# Altium schematic sheet DSP.SchDoc
size A
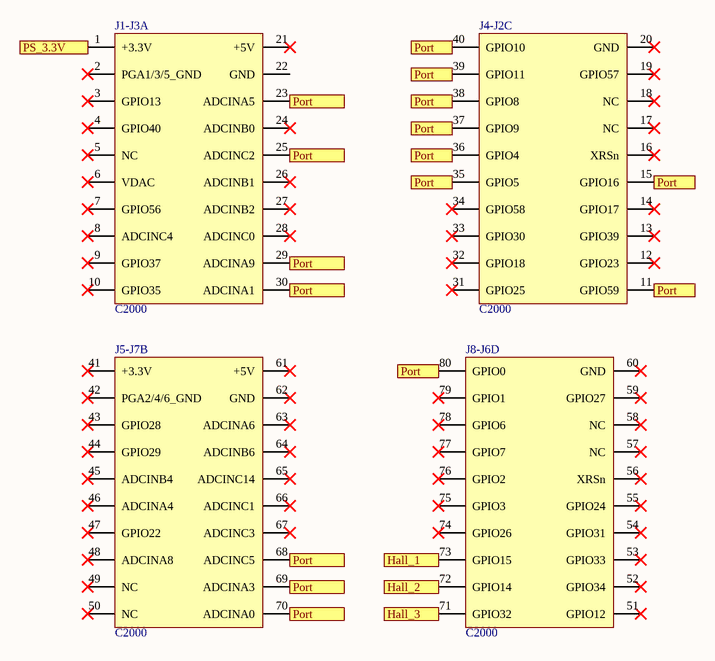
[diagram p0: DSP.SchDoc]

## Parts
J1-J3  C2000  [C2000]  (part A of 4)
J4-J2  C2000  [C2000]  (part C of 4)
J5-J7  C2000  [C2000]  (part B of 4)
J8-J6  C2000  [C2000]  (part D of 4)

## Ports
Hall_1 (in), Hall_2 (in), Hall_3 (in), Port (in), Port (out), PS_3.3V (in)

## Nets
Hall_1: J8-J6.73(GPIO15) ; port Hall_1
Hall_2: J8-J6.72(GPIO14) ; port Hall_2
Hall_3: J8-J6.71(GPIO32) ; port Hall_3
Port: J1-J3.23(ADCINA5) J1-J3.25(ADCINC2) J1-J3.29(ADCINA9) J1-J3.30(ADCINA1) J4-J2.11(GPIO59) J4-J2.15(GPIO16) J4-J2.35(GPIO5) J4-J2.36(GPIO4) J4-J2.37(GPIO9) J4-J2.38(GPIO8) J4-J2.39(GPIO11) J4-J2.40(GPIO10) J5-J7.68(ADCINC5) J5-J7.69(ADCINA3) J5-J7.70(ADCINA0) J8-J6.80(GPIO0) ; port Port
PS_3.3V: J1-J3.1(+3.3V) ; port PS_3.3V

Not connected (* = marked no-connect by the designer): J1-J3 2(PGA1/3/5_GND)* 3(GPIO13)* 4(GPIO40)* 5(NC)* 6(VDAC)* 7(GPIO56)* 8(ADCINC4)* 9(GPIO37)* 10(GPIO35)* 21(+5V)* 22(GND) 24(ADCINB0)* 26(ADCINB1)* 27(ADCINB2)* 28(ADCINC0)*; J4-J2 12(GPIO23)* 13(GPIO39)* 14(GPIO17)* 16(XRSn)* 17(NC)* 18(NC)* 19(GPIO57)* 20(GND)* 31(GPIO25)* 32(GPIO18)* 33(GPIO30)* 34(GPIO58)*; J5-J7 41(+3.3V)* 42(PGA2/4/6_GND)* 43(GPIO28)* 44(GPIO29)* 45(ADCINB4)* 46(ADCINA4)* 47(GPIO22)* 48(ADCINA8)* 49(NC)* 50(NC)* 61(+5V)* 62(GND)* 63(ADCINA6)* 64(ADCINB6)* 65(ADCINC14)* 66(ADCINC1)* 67(ADCINC3)*; J8-J6 51(GPIO12)* 52(GPIO34)* 53(GPIO33)* 54(GPIO31)* 55(GPIO24)* 56(XRSn)* 57(NC)* 58(NC)* 59(GPIO27)* 60(GND)* 74(GPIO26)* 75(GPIO3)* 76(GPIO2)* 77(GPIO7)* 78(GPIO6)* 79(GPIO1)*

## Library data of the parts
J1-J3 J4-J2 J5-J7 J8-J6 = C2000: F280049C; Parameter 1: test 2